# EAGLE design rf_transmitter_using_jockey_switch (EAGLE 6.1)
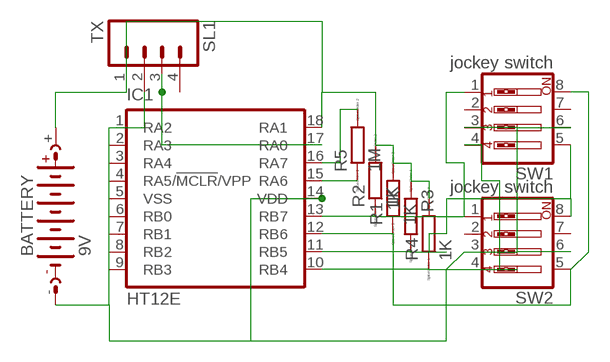
[diagram p0: schematic, sheet 1]

## Parts
BATTERY  9V  AB9V  [AB9V]
IC1  HT12E  PIC16F1826/27P  [DIL18]
R1  1K  R0204/7  [0204/7]
R2  1K  R0204/7  [0204/7]
R3  1K  R0204/7  [0204/7]
R4  1K  R0204/7  [0204/7]
R5  1M  R0204/7  [0204/7]
SL1  TX  M04  [04P]
SW1  jockey switch  SW_DIP-4  [EDG-04]
SW2  jockey switch  SW_DIP-4  [EDG-04]

## Nets
N$1: IC1.10(RB4) R4.1 SW1.4 SW2.4
N$2: IC1.11(RB5) R3.2 SW1.5 SW2.8
N$3: IC1.12(RB6) R1.1 SW1.8 SW2.5
N$4: IC1.13(RB7) R2.1 SW1.1 SW2.1
N$5: IC1.15(RA6) R5.1
N$6: IC1.16(RA7) R5.2
N$7: BATTERY.+ IC1.18(RA1) R1.2 R2.2 R3.1 R4.2 SL1.1
N$8: BATTERY.- IC1.1(RA2) IC1.2(RA3) IC1.3(RA4) IC1.4(RA5/!MCLR!/VPP) IC1.5(VSS) IC1.6(RB0) IC1.7(RB1) IC1.8(RB2) IC1.9(RB3) IC1.14(VDD) SL1.2 SW1.3 SW1.6 SW2.3 SW2.6
N$9: IC1.17(RA0) SL1.3
Unconnected: SL1.4 SW1.2 SW1.7 SW2.2 SW2.7

## Library data of the parts
BATTERY = battery:AB9V: 9-V BATTERY CLIP
IC1 = microchip:PIC16*F1826/27: 18/20/28-Pin Flash Microcontrollers with nanoWatt XLP Technology Source: www.microchip.com PIC16F1827.pdf
R1-R5 = eagle-ltspice:R: RESISTOR, European symbol; SPICEMODEL: NONE; SPICEPREFIX: R
SL1 = con-amp-quick:M04: AMP QUICK CONNECTOR; OC_FARNELL: unknown; OC_NEWARK: unknown
SW1 SW2 = special:SW_DIP-4: DIP SWITCH

## Board
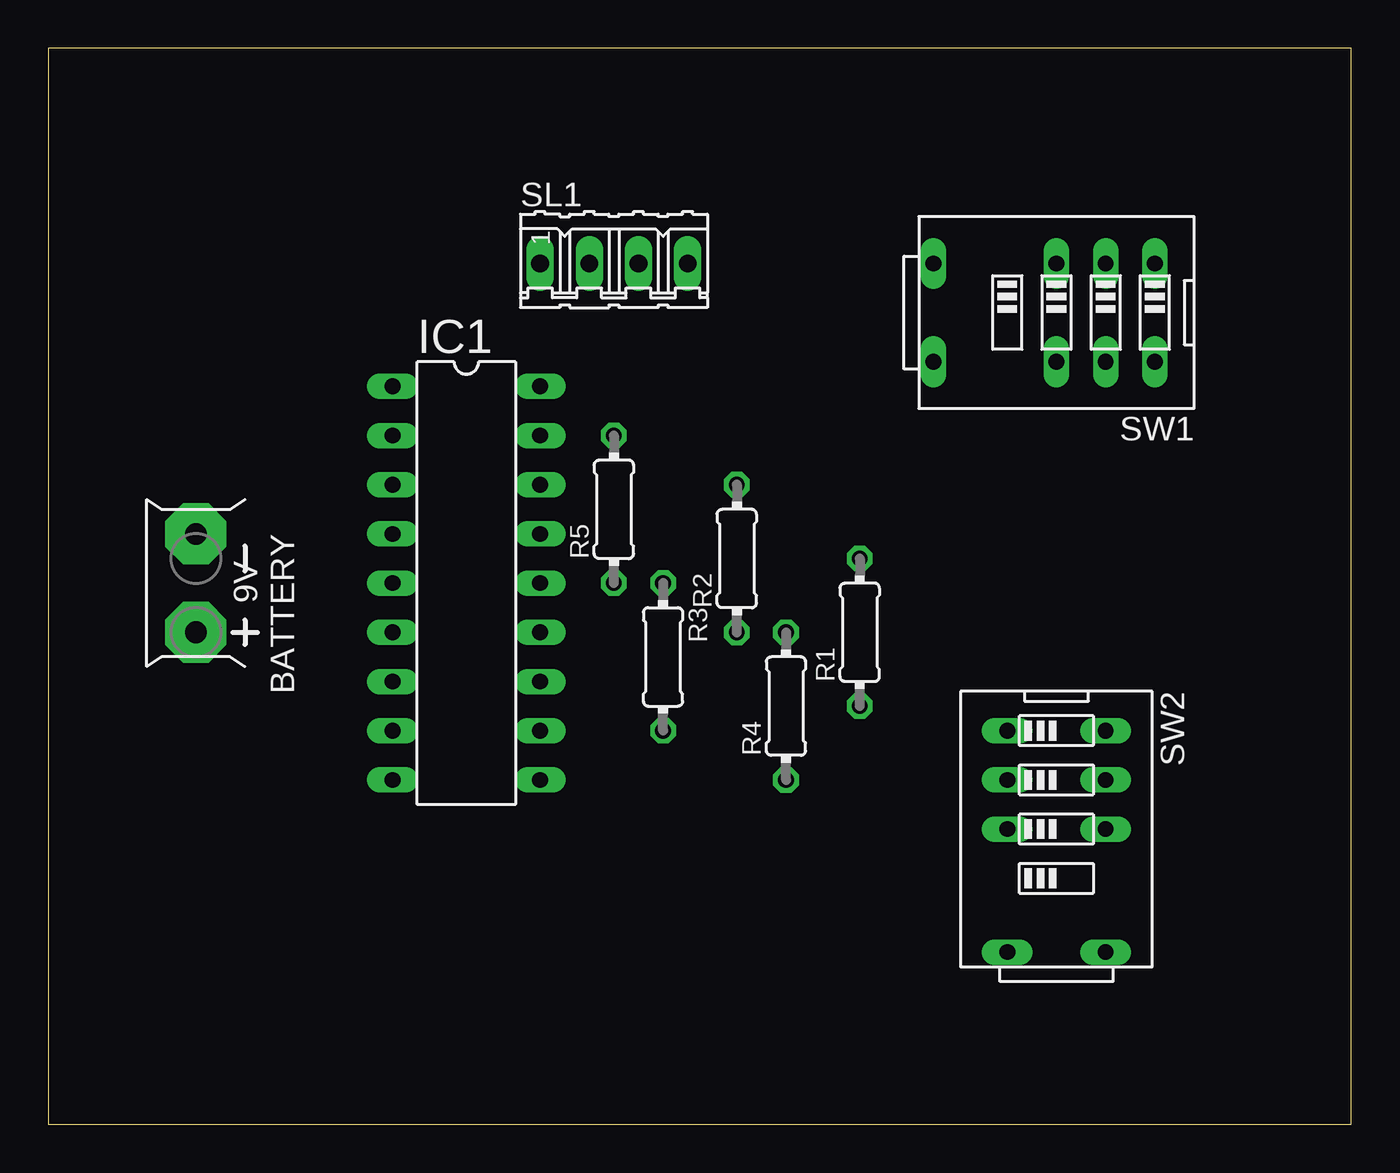
[diagram p1: board, top side]
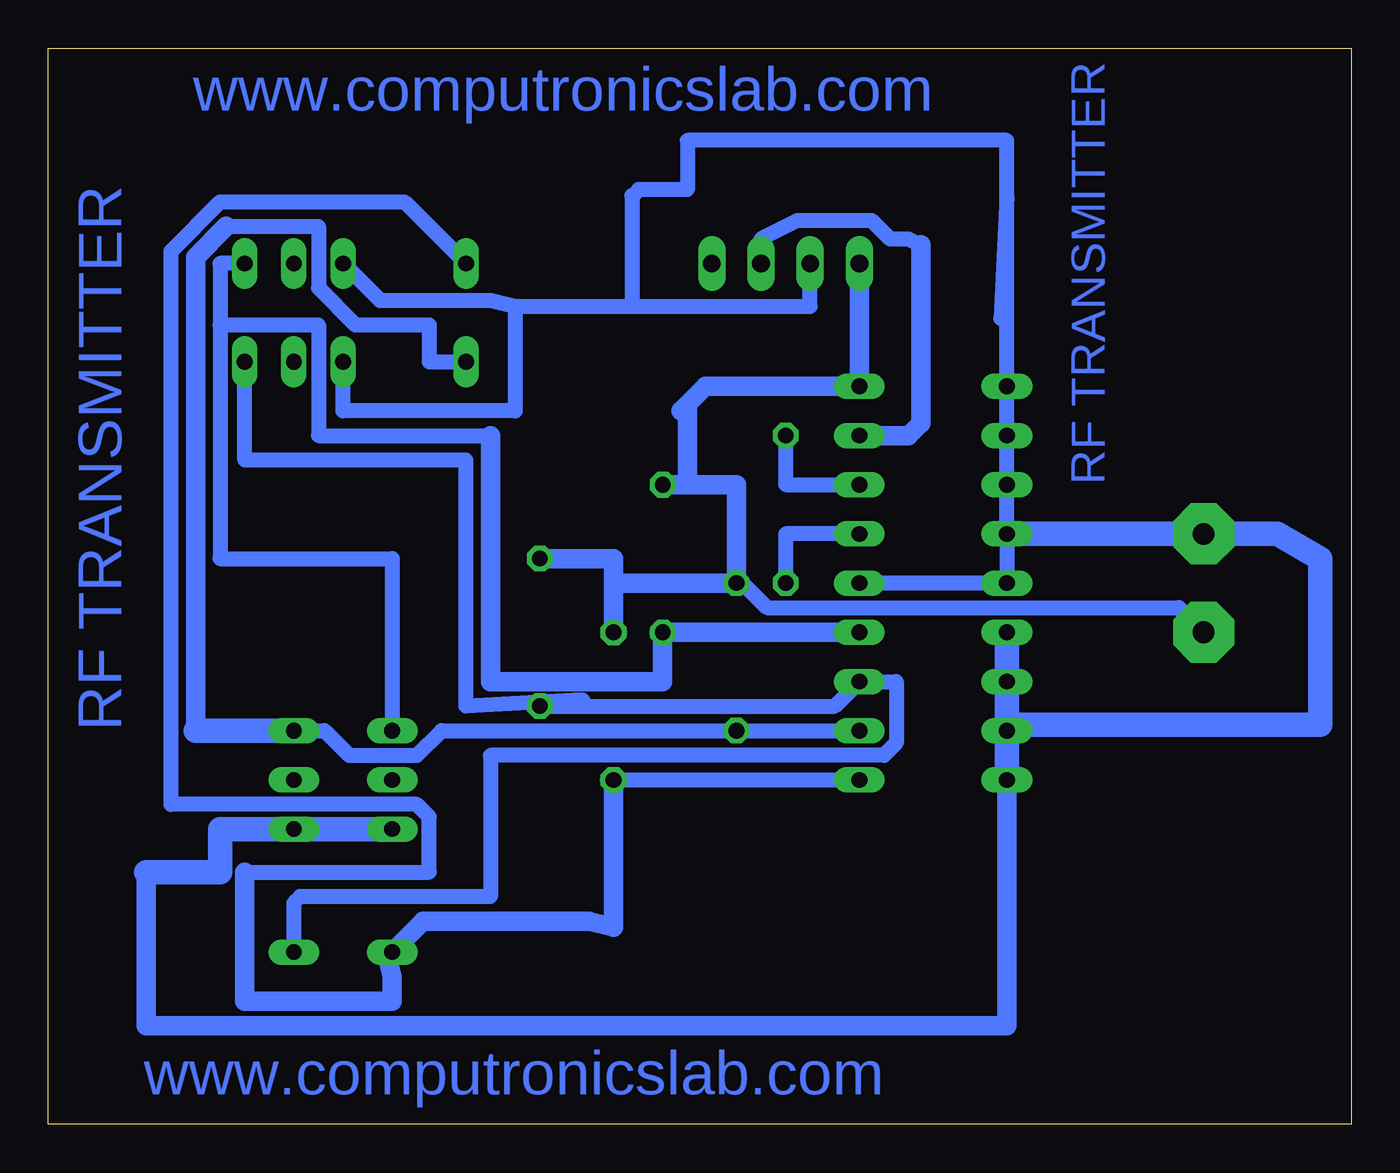
[diagram p2: board, bottom side, seen from below]

Size 67.29 x 55.55 mm. Coordinates in mm from the lower left corner, seen from the top.
Outline: 0,0 67.29,0 67.29,55.55 0,55.55 0,0
Copper layers (1*16): Top 0.035mm / dielectric 1.5mm / Bottom 0.035mm
Design rules: minimum track width 30mil, minimum drill 24mil, track to track 8mil, track to pad 8mil, pad to pad 8mil, via to via 8mil, smd to smd 8mil, copper to edge 40mil, drill to drill 8mil, minimum pad ring 10mil, minimum via ring 8mil, stop-mask expansion 4mil, vias tented up to drill 0mil, thermal gap 10mil

### Footprints (pad centres in the part's own frame; a part is rotated, then mirrored left to right if it is on the bottom)
AB9V = drill 1.118 pad 3.15 octagon: + 0,2.54; - 0,-2.54
DIL18 = drill 0.813 long: 1 -10.16,-3.81; 2 -7.62,-3.81; 3 -5.08,-3.81; 4 -2.54,-3.81; 5 0,-3.81; 6 2.54,-3.81; 7 5.08,-3.81; 8 7.62,-3.81; 9 10.16,-3.81; 10 10.16,3.81; 11 7.62,3.81; 12 5.08,3.81; 13 2.54,3.81; 14 0,3.81; 15 -2.54,3.81; 16 -5.08,3.81; 17 -7.62,3.81; 18 -10.16,3.81
0204/7 = drill 0.813 octagon: 1 -3.81,0; 2 3.81,0
04P = drill 0.914 long: 1 -3.81,0; 2 -1.27,0; 3 1.27,0; 4 3.81,0
EDG-04 = drill 0.813 long: 1 -3.81,-2.54; 2 -1.27,-2.54; 3 1.27,-2.54; 4 7.62,-2.54; 5 7.62,2.54; 6 1.27,2.54; 7 -1.27,2.54; 8 -3.81,2.54

### Placement (x,y rotation side)
BATTERY  7.62,27.94 180 top
IC1  21.59,27.94 270 top
R1  41.91,25.4 90 top
R2  35.56,29.21 90 top
R3  31.75,24.13 270 top
R4  38.1,21.59 90 top
R5  29.21,31.75 90 top
SL1  29.21,44.45 0 top
SW1  53.34,41.91 180 top
SW2  52.07,16.51 270 top

### Tracks (layer width: path | path; a pad name or v marks a point on that pad's centre or on a via)
N$1
  Bottom 0.762: IC1.10 R4.1 38.42,17.78 | SW1.4 48.89,47.62 58.42,47.62 60.96,45.09 60.96,16.51 48.26,16.51 47.62,15.88 47.62,13.02 57.15,13.02 | 49.85,8.89 SW2.4
  Bottom 1.016: SW2.4 47.94,10.48 39.37,10.48 38.1,10.16 R4.1 | 57.15,13.02 57.15,6.35 49.53,6.35 49.53,7.62 49.85,8.89
N$2
  Bottom 0.762: IC1.11 R3.2 46.99,20.32 48.26,19.05 51.75,19.05 53.02,20.32 SW2.8 | SW1.5 47.62,39.37 47.62,41.27 51.43,41.27 53.34,43.18 53.34,46.35 58.1,46.35
  Bottom 1.016: 58.1,46.35 59.69,44.77 59.69,20.32
  Bottom 1.27: SW2.8 59.69,20.32
N$3
  Bottom 0.762: R1.1 39.69,21.59 | 39.69,21.59 26.67,21.59 IC1.12 23.49,22.86 23.49,19.68 24.13,19.05 44.45,19.05 44.45,11.75 54.29,11.75 54.61,11.43 SW2.5 | SW1.8 57.15,34.29 45.72,34.29 45.72,21.59 39.69,21.91 39.69,21.59
N$4
  Bottom 0.762: SW2.1 49.53,29.21 58.42,29.21 58.42,41.27 | 58.42,41.27 58.42,44.45 SW1.1 | 44.45,35.56 53.34,35.56 53.34,41.27 58.42,41.27 | 35.88,25.4 R2.1
  Bottom 1.016: IC1.13 R2.1 35.56,22.86 44.45,22.86 44.45,35.56
N$5
  Bottom 0.762: R5.1 29.21,30.48 IC1.15
N$6
  Bottom 0.762: IC1.16 29.21,33.02 R5.2
N$7
  Bottom 0.762: 34.29,36.83 34.61,36.83 | 37.78,25.4 R4.2 | 8.89,26.67 30.16,26.67 31.43,27.94 R3.1
  Bottom 0.813: 8.89,26.67 BATTERY.+
  Bottom 1.016: R1.2 38.1,29.21 38.1,27.94 | SL1.1 IC1.18 33.34,38.1 34.61,36.83 | 34.29,36.83 34.29,33.02 R2.2 31.75,33.02 R3.1 38.1,27.94 | 38.1,27.94 R4.2
N$8
  Bottom 0.406: 37.15,47.94 36.83,47.94 36.83,48.26
  Bottom 0.762: 62.23,11.43 62.23,12.38 | SW1.6 52.07,36.83 43.18,36.83 43.18,42.23 | 43.18,42.23 44.45,42.55 50.16,42.55 SW1.3 | SL1.2 27.94,42.23 37.15,42.23 | 43.18,42.23 37.15,42.23 | IC1.14 IC1.5 IC1.4 IC1.3 IC1.2 IC1.1 17.78,47.94 | 37.15,47.94 37.15,42.23 | 17.78,47.94 17.78,50.8 34.29,50.8 34.29,48.26 36.83,48.26 | 17.78,47.94 18.1,41.59 | 17.46,20.64 IC1.7
  Bottom 1.016: IC1.9 17.78,5.08 62.23,5.08 62.23,11.43 62.23,13.02
  Bottom 1.27: SW2.3 SW2.6 58.42,15.24 58.42,13.02 62.23,13.02 | IC1.6 IC1.7 IC1.8 IC1.9 18.1,17.78 | IC1.4 BATTERY.- 3.81,30.48 1.59,29.21 1.59,20.64 17.46,20.64
N$9
  Bottom 0.762: 22.23,45.4 22.86,45.72 23.81,45.72 24.77,46.67 28.57,46.67 30.48,45.72 30.48,44.77 SL1.3
  Bottom 1.016: IC1.17 22.86,35.56 22.23,36.2 22.23,37.47 22.23,45.4

### Text on the board
Bottom: www.computronicslab.com | RF TRANSMITTER | RF TRANSMITTER | www.computronicslab.com